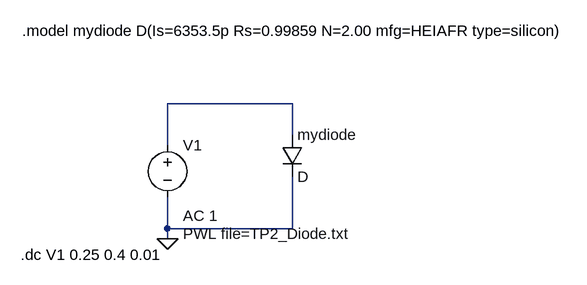
[diagram p0: schematic b112_StudentVersion.asc]
b112_StudentVersion.asc, the LTspice schematic file:
Version 4
SHEET 1 1204 680
WIRE 272 -64 80 -64
WIRE 272 -16 272 -64
WIRE 80 0 80 -64
WIRE 80 128 80 80
WIRE 272 128 272 48
WIRE 272 128 80 128
WIRE 80 144 80 128
FLAG 80 144 0
SYMBOL voltage 80 -16 R0
WINDOW 123 24 124 Left 2
WINDOW 39 0 0 Left 2
WINDOW 3 24 152 Left 2
SYMATTR Value2 AC 1
SYMATTR InstName V1
SYMATTR Value PWL file=TP2_Diode.txt
SYMBOL diode 256 -16 R0
SYMATTR InstName mydiode
TEXT -144 -176 Left 2 !.model mydiode D(Is=6353.5p Rs=0.99859 N=2.00 mfg=HEIAFR type=silicon)
TEXT -146 168 Left 2 !.dc V1 0.25 0.4 0.01

The netlist it stands for:
* b112_StudentVersion.asc
V1 N001 0 PWL file=TP2_Diode.txt AC 1
D§mydiode N001 0 D
.model D D
.lib standard.dio
.model mydiode D(Is=6353.5p Rs=0.99859 N=2.00 mfg=HEIAFR type=silicon)
.dc V1 0.25 0.4 0.01
.backanno
.end